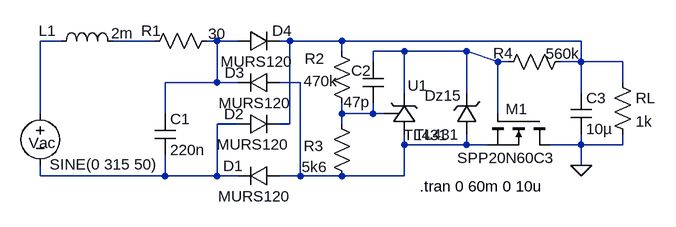
[diagram p0: schematic PreReg100HzSw.asc]
PreReg100HzSw.asc, the LTspice schematic file:
Version 4
SHEET 1 880 680
WIRE -528 160 -560 160
WIRE -384 160 -448 160
WIRE -288 160 -304 160
WIRE -256 160 -288 160
WIRE -176 160 -192 160
WIRE -96 160 -176 160
WIRE 272 160 -96 160
WIRE -96 176 -96 160
WIRE 0 176 -48 176
WIRE 96 176 0 176
WIRE -48 192 -48 176
WIRE 144 192 96 176
WIRE 160 192 144 192
WIRE 272 192 272 160
WIRE 272 192 240 192
WIRE 336 192 272 192
WIRE -288 224 -288 160
WIRE -288 224 -368 224
WIRE -256 224 -288 224
WIRE -160 224 -192 224
WIRE 336 224 336 192
WIRE 0 240 0 176
WIRE 96 240 96 176
WIRE 272 240 272 192
WIRE -560 272 -560 160
WIRE -368 272 -368 224
WIRE -96 272 -96 256
WIRE -48 272 -48 256
WIRE -48 272 -96 272
WIRE -32 272 -48 272
WIRE 144 272 144 192
WIRE -256 288 -288 288
WIRE -176 288 -176 160
WIRE -176 288 -192 288
WIRE -96 288 -96 272
WIRE 0 320 0 304
WIRE 96 320 96 304
WIRE 96 320 0 320
WIRE 128 320 96 320
WIRE 272 320 272 304
WIRE 272 320 224 320
WIRE 336 320 336 304
WIRE 336 320 272 320
WIRE 272 352 272 320
WIRE -560 368 -560 352
WIRE -368 368 -368 336
WIRE -368 368 -560 368
WIRE -288 368 -288 288
WIRE -288 368 -368 368
WIRE -256 368 -288 368
WIRE -160 368 -160 224
WIRE -160 368 -192 368
WIRE -96 368 -160 368
WIRE 0 368 0 320
WIRE 0 368 -96 368
FLAG 272 352 0
SYMBOL zener 112 304 R180
WINDOW 0 24 60 Left 0
WINDOW 3 27 -80 Invisible 0
SYMATTR InstName Dz15
SYMATTR Value BZX84C15L
SYMBOL nmos 224 272 R90
WINDOW 0 -7 34 VRight 0
WINDOW 3 68 -7 VRight 0
SYMATTR InstName M1
SYMATTR Value SPP20N60C3
SYMBOL cap -384 272 R0
SYMATTR InstName C1
SYMATTR Value 220n
SYMBOL diode -192 352 R90
WINDOW 0 16 71 VBottom 0
WINDOW 3 32 39 VTop 0
SYMATTR InstName D1
SYMATTR Value MURS120
SYMBOL diode -256 272 M90
WINDOW 0 16 -6 VBottom 0
WINDOW 3 32 23 VTop 0
SYMATTR InstName D2
SYMATTR Value MURS120
SYMBOL diode -192 208 R90
WINDOW 0 16 69 VBottom 0
WINDOW 3 32 38 VTop 0
SYMATTR InstName D3
SYMATTR Value MURS120
SYMBOL diode -256 144 M90
WINDOW 0 16 68 VBottom 0
WINDOW 3 32 29 VTop 0
SYMATTR InstName D4
SYMATTR Value MURS120
SYMBOL voltage -560 256 R0
WINDOW 0 -18 61 Left 0
WINDOW 3 181 94 Right 0
WINDOW 123 0 0 Left 0
WINDOW 39 24 132 Left 0
SYMATTR InstName Vac
SYMATTR Value SINE(0 315 50)
SYMBOL res -288 144 R90
WINDOW 0 16 101 VBottom 0
WINDOW 3 -11 0 VTop 0
SYMATTR InstName R1
SYMATTR Value 30
SYMATTR SpiceLine tol=1 pwr=0.1
SYMBOL ind -544 176 R270
WINDOW 0 16 -5 VTop 0
WINDOW 3 44 110 VBottom 0
SYMATTR InstName L1
SYMATTR Value 2m
SYMATTR SpiceLine Ipk=1.5 Rser=1.3 Rpar=45000 Cpar=220f mfg="Gowanda" pn="894AT1004V"
SYMBOL res -112 160 R0
WINDOW 0 -41 27 Left 0
WINDOW 3 -43 62 Left 0
SYMATTR InstName R2
SYMATTR Value 470k
SYMBOL res -112 272 R0
WINDOW 0 -43 50 Left 0
WINDOW 3 -46 82 Left 0
SYMATTR InstName R3
SYMATTR Value 5k6
SYMBOL cap -64 192 R0
WINDOW 0 -18 14 Left 0
WINDOW 3 -29 62 Left 0
SYMATTR InstName C2
SYMATTR Value 47p
SYMBOL res 144 208 R270
WINDOW 0 14 8 VTop 0
WINDOW 3 44 100 VBottom 0
SYMATTR InstName R4
SYMATTR Value 560k
SYMBOL cap 256 240 R0
SYMATTR InstName C3
SYMATTR Value 10µ
SYMBOL Vreg\\tl431 -16 240 R0
WINDOW 0 21 -11 Left 0
WINDOW 38 50 65 Center 0
SYMATTR InstName U1
SYMATTR SpiceModel TL431
SYMBOL res 320 208 R0
SYMATTR InstName RL
SYMATTR Value 1k
TEXT 24 384 Left 0 !.tran 0 60m 0 10u

The netlist it stands for:
* PreReg100HzSw.asc
Dz15 N006 N005 BZX84C15L
M1 0 N005 N006 N006 SPP20N60C3
C1 N003 N008 220n
D1 N006 N008 MURS120
D2 N008 N004 MURS120
D3 N006 N003 MURS120
D4 N003 N004 MURS120
Vac N001 N008 SINE(0 315 50)
R1 N003 N002 30 tol=1 pwr=0.1
L1 N001 N002 2m Ipk=1.5 Rser=1.3 Rpar=45000 Cpar=220f mfg="Gowanda" pn="894AT1004V"
R2 N004 N007 470k
R3 N007 N006 5k6
C2 N005 N007 47p
R4 N005 N004 560k
C3 N004 0 10µ
XU1 N005 N006 N007 TL431 TL431  ; pins K A R
RL N004 0 1k
.model D D
.lib standard.dio
.model NMOS NMOS
.model PMOS PMOS
.lib standard.mos
.tran 0 60m 0 10u
.backanno
.end